# Altium schematic sheet Main IF Board 2.SchDoc: Test circuit for image rejecting mixer
size A3; Revision: 0
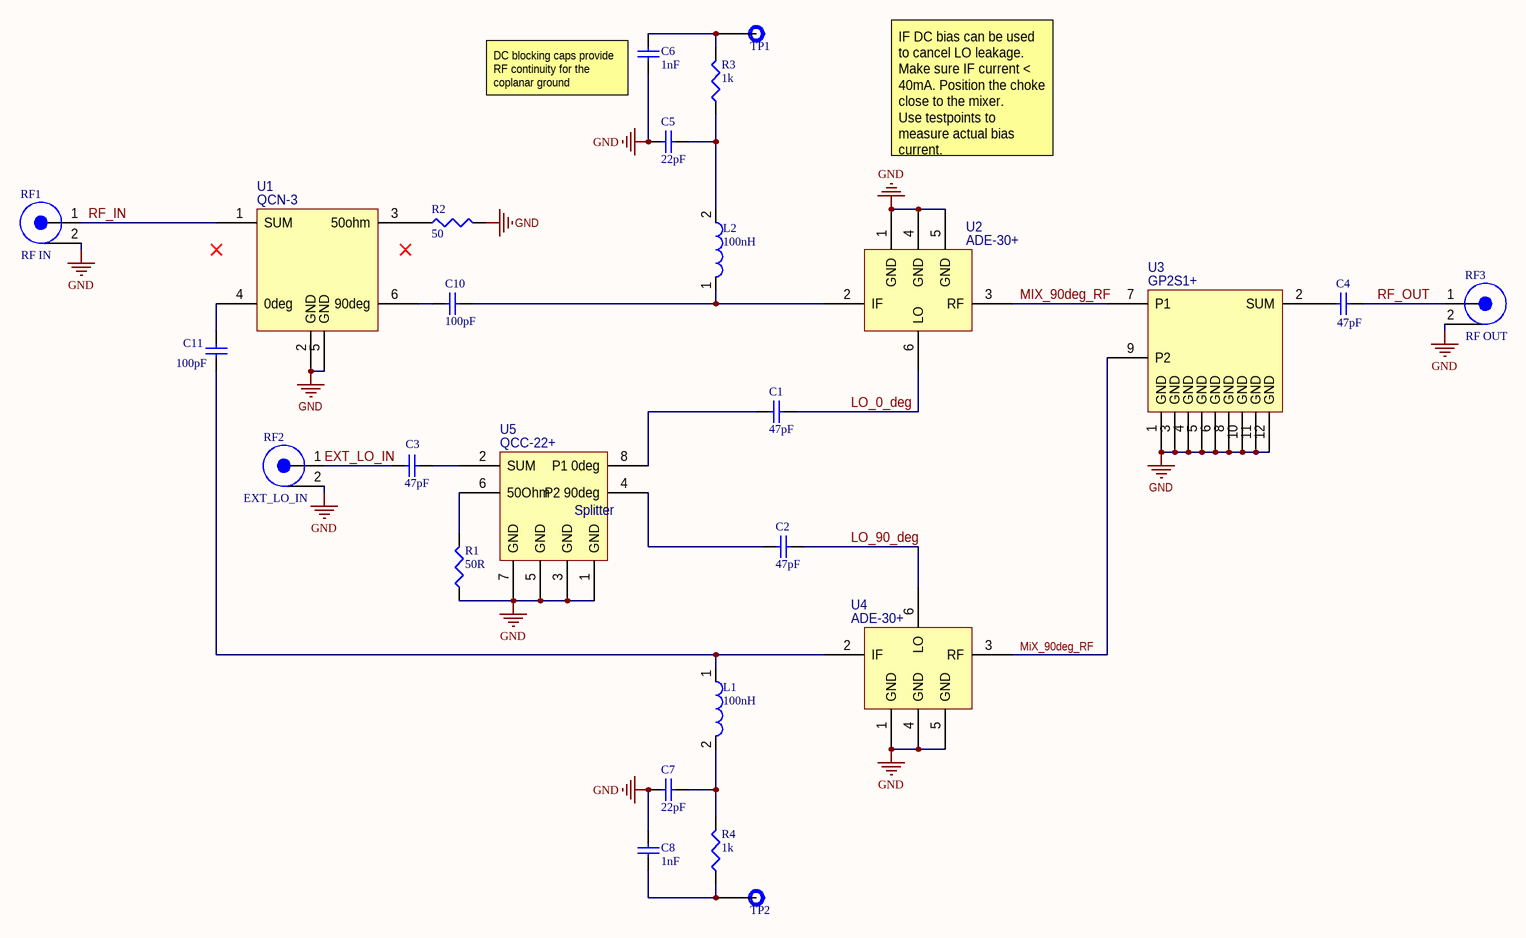
[diagram p0: Main IF Board 2.SchDoc]

## Parts
C1  value 47pF  [CAP0402]  (hidden comment: ATC520L103KT16T)
C2  value 47pF  [CAP0402]  (hidden comment: ATC520L103KT16T)
C3  value 47pF  [CAP0402]  (hidden comment: ATC520L103KT16T)
C4  value 47pF  [CAP0402]  (hidden comment: ATC520L103KT16T)
C5  value 22pF  [CAP0402]  (hidden comment: Capacitor)
C6  value 1nF  [CAP0603]  (hidden comment: Capacitor)
C7  value 22pF  [CAP0402]  (hidden comment: Capacitor)
C8  value 1nF  [CAP0603]  (hidden comment: Capacitor)
C10  value 100pF  [CAP0402]  (hidden comment: Capacitor)
C11  value 100pF  [CAP0402]  (hidden comment: Capacitor)
L1  value 100nH  [Coilcraft_BCL-122]  (hidden comment: Inductor)
L2  value 100nH  [Coilcraft_BCL-122]  (hidden comment: Inductor)
R1  value 50R  [RES0603]  (hidden comment: Resistor)
R2  value 50  [RES0603]  (hidden comment: Resistor)
R3  value 1k  [RES0603]  (hidden comment: Resistor)
R4  value 1k  [RES0603]  (hidden comment: Resistor)
RF1  RF IN  [SMA_edge_launch_cutout_Cinch]
RF2  EXT_LO_IN  [SMA_edge_launch_cutout_Cinch]
RF3  RF OUT  [SMA_edge_launch_cutout_Cinch]
TP1  Test point  [1XHeader 100mil]  (value not drawn)  (no BOM)
TP2  Test point  (value not drawn)  (no BOM)
U1  QCN-3
U2  ADE-30+  [Minicircuits_CD542]
U3  GP2S1+  [DQ1225]
U4  ADE-30+  [Minicircuits_CD542]
U5  QCC-22+  [Minicircuits_GF981]

## Nets
GND: C5.1 C6.1 C7.1 C8.1 R1.1 R2.2 RF1.2 RF2.2 RF3.2 U1.2(GND) U1.5(GND) U2.1(GND) U2.4(GND) U2.5(GND) U3.1(GND) U3.3(GND) U3.4(GND) U3.5(GND) U3.6(GND) U3.8(GND) U3.10(GND) U3.11(GND) U3.12(GND) U4.1(GND) U4.4(GND) U4.5(GND) U5.1(GND) U5.3(GND) U5.5(GND) U5.7(GND)
EXT_LO_IN: C3.1 RF2.1
LO_0_deg: C1.2 U2.6(LO)
LO_90_deg: C2.1 U4.6(LO)
MIX_90deg_RF: U2.3(RF) U3.7(P1) U3.9(P2) U4.3(RF)
RF_IN: RF1.1 U1.1(SUM)
RF_OUT: C4.1 RF3.1
NetC1_1: C1.1 U5.8(P1_0deg)
NetC2_2: C2.2 U5.4(P2_90deg)
NetC3_2: C3.2 U5.2(SUM)
NetC4_2: C4.2 U3.2(SUM)
NetC5_2: C5.2 L2.2 R3.1
NetC6_2: C6.2 R3.2 TP1.1
NetC7_2: C7.2 L1.2 R4.1
NetC8_2: C8.2 R4.2 TP2.1
NetC10_1: C10.1 U1.6(90deg)
NetC10_2: C10.2 L2.1 U2.2(IF)
NetC11_1: C11.1 L1.1 U4.2(IF)
NetC11_2: C11.2 U1.4(0deg)
NetR1_2: R1.2 U5.6(50Ohm)
NetR2_1: R2.1 U1.3(50ohm)

## Notes on the sheet
- (near C6) DC blocking caps provide RF continuity for the coplanar ground
- IF DC bias can be used to cancel LO leakage. Make sure IF current < 40mA. Position the choke close to the mixer.
  Use testpoints to measure actual bias current.
- (in symbol minicircuits_QCC-22+) Splitter

## Library data of the parts
C1-C4 = Capacitor
RF1-RF3 = RF_connector: RF connector w/  pin and barrel
U2 U4 = minicircuits_ADE-30+: Minicircuits mixer ADE-30+, 200MHz-3000MHz
U5 = minicircuits_QCC-22+: Mini-Circuits_ power splitter/combiner QCC-22+, 1.5-2.5GHz
C5-C8 C10 C11 = Capacitor
  C10 C11: Dielectric: *; Model: *; Voltage: *
R1-R4 = Resistor
  R2-R4: Type: *; Model: *